# EasyEDA Pro project WCH-Link.epro

# Schematic Schematic1
Create Date: 2023-04-04; Page Name: P1; Project Name: WCH-Link; Schematic Name: Schematic1; Update Date: 2023-04-10; Company: 嘉立创EDA; Page Size: A4; Version: V1.0
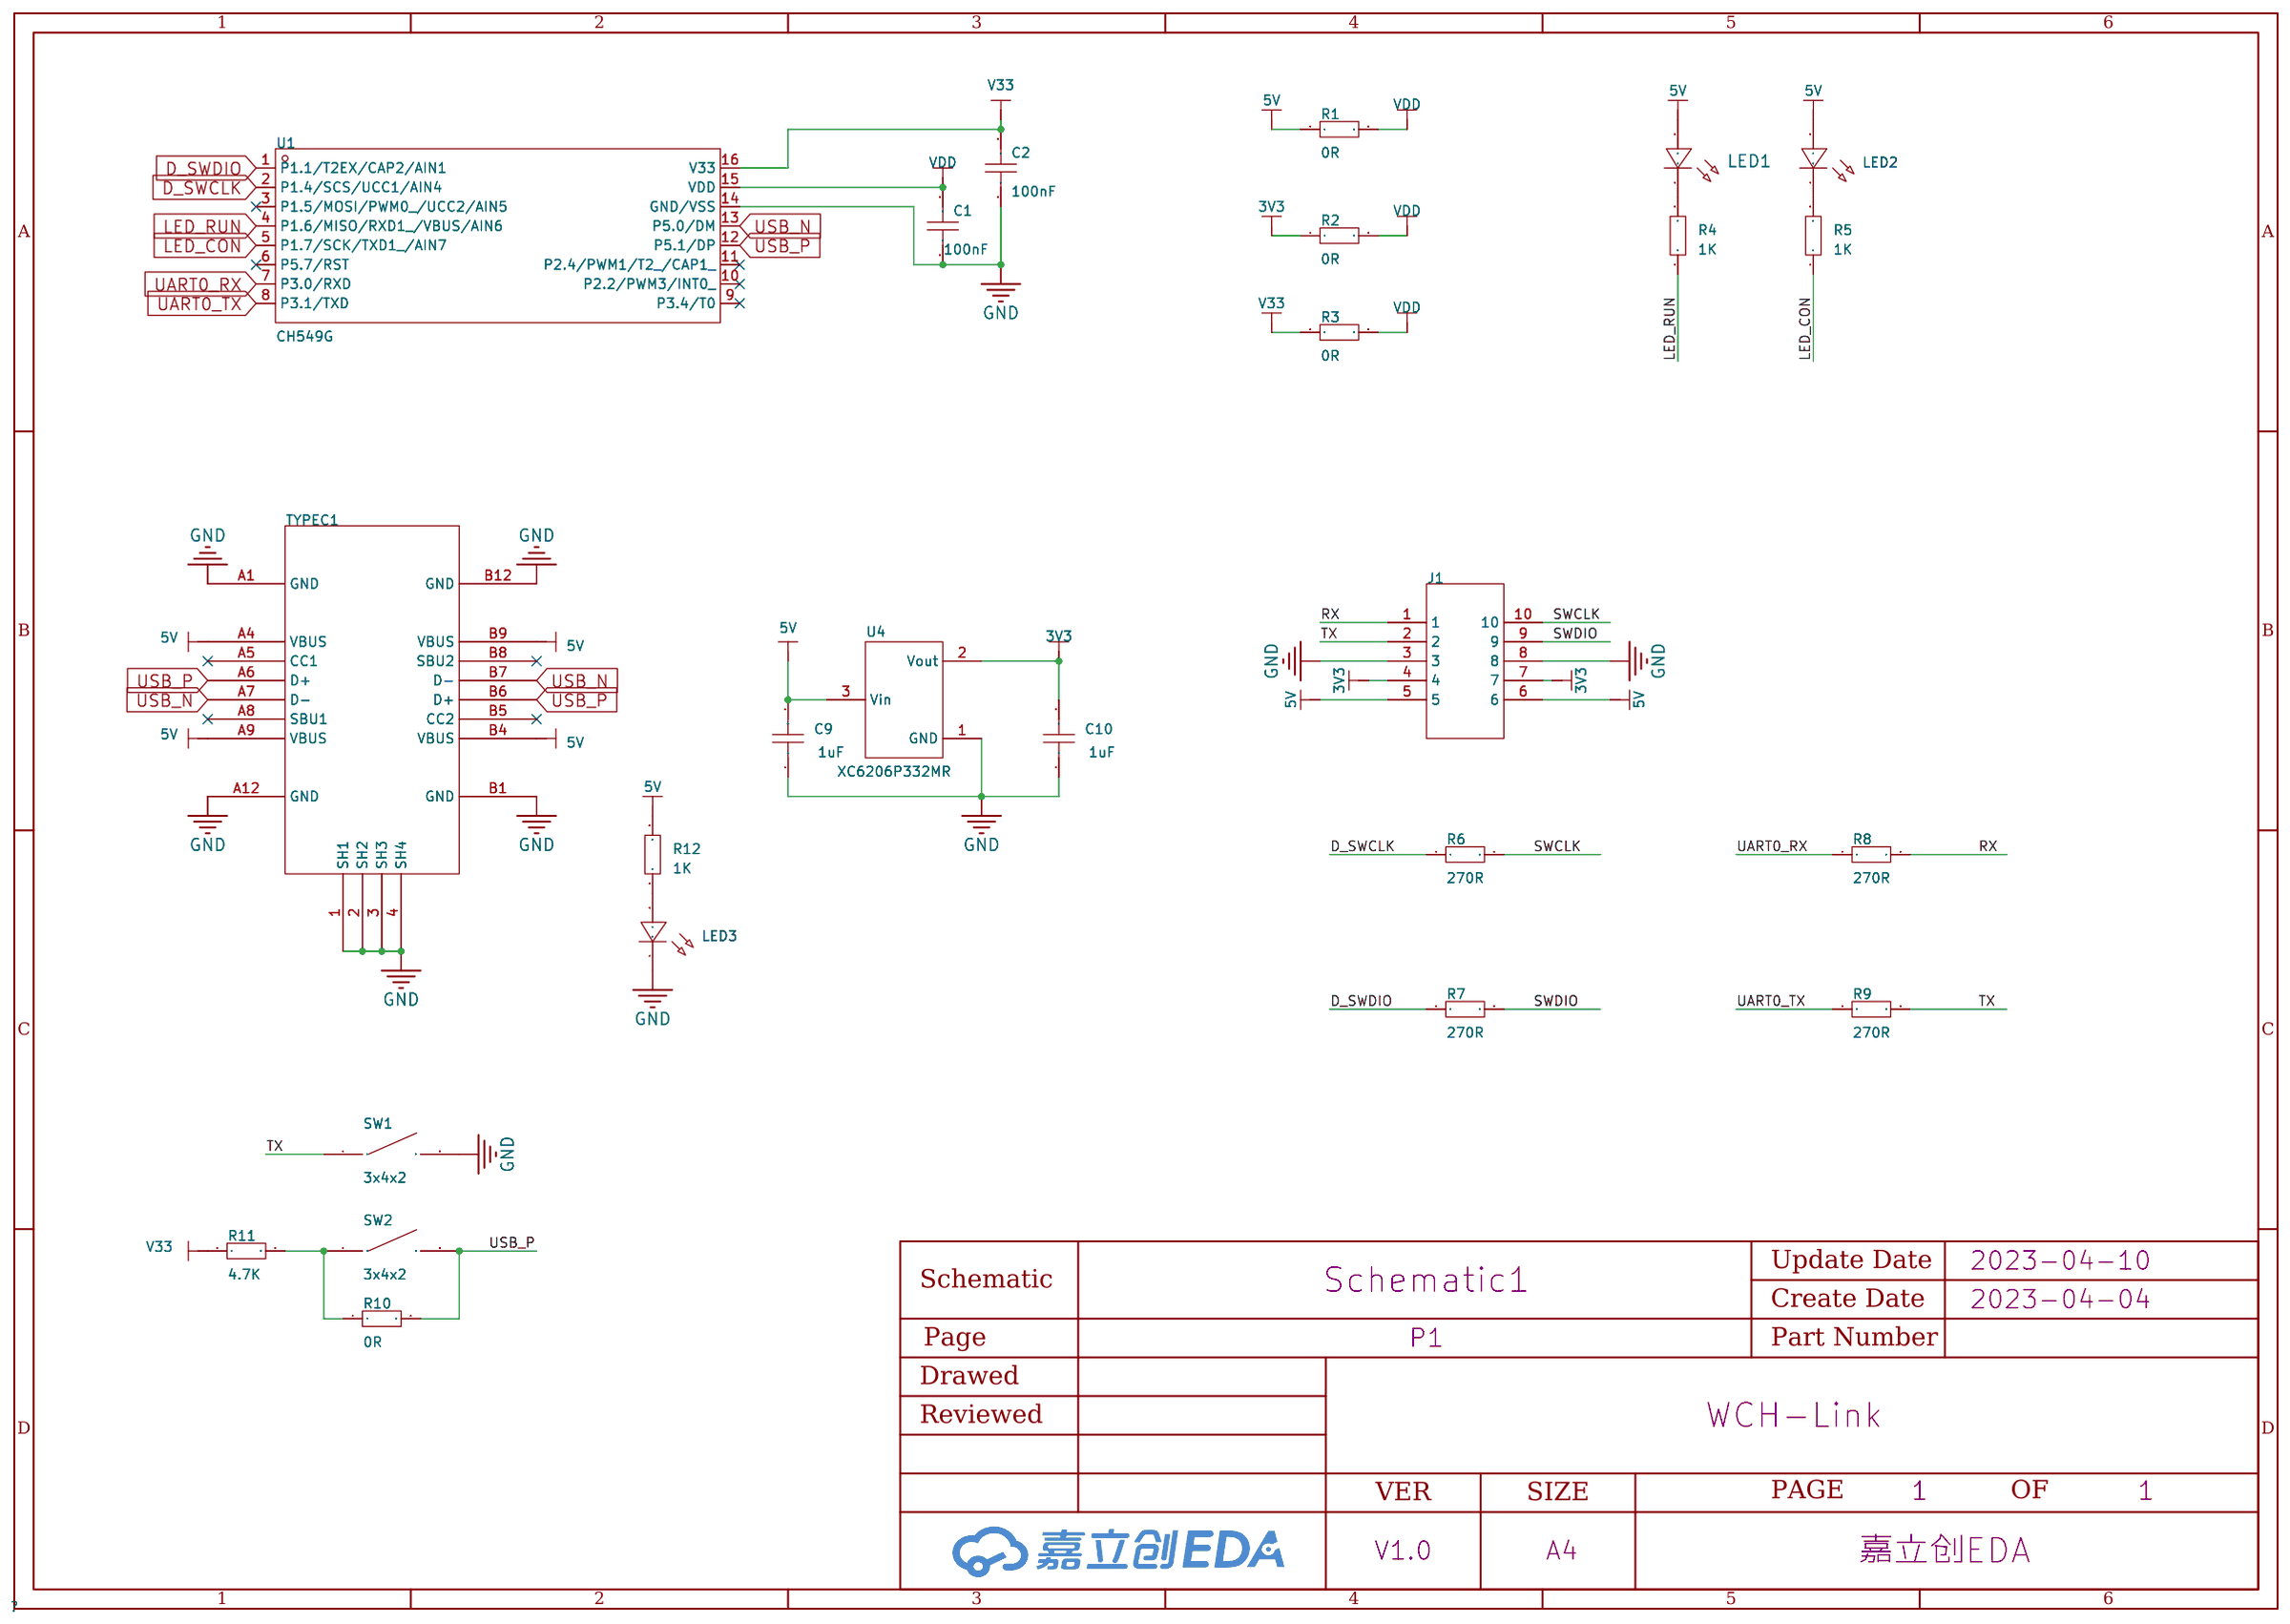
[diagram p0: schematic sheet]

## Parts
C1  100nF  [C0603]
C2  100nF  [C0603]
C9  1uF  [C0603]
C10  1uF  [C0603]
J1  -  [WCH-link-J]
LED1  -  [LED_0805]
LED2  -  [LED_0805]
LED3  -  [LED_0805]
R1  0R  [R0603]
R2  0R  [R0603]
R3  0R  [R0603]
R4  1K  [R0603]
R5  1K  [R0603]
R6  270R  [R0603]
R7  270R  [R0603]
R8  270R  [R0603]
R9  270R  [R0603]
R10  0R  [R0603]
R11  4.7K  [R0603]
R12  1K  [R0603]
SW1  3x4x2  [SW-SMD_L4.0-W2.9-LS5.0]
SW2  3x4x2  [SW-SMD_L4.0-W2.9-LS5.0]
TYPEC1  -  [TypeC-16p]
U1  CH549G  [SOP-16_L10.0-W3.9-P1.27-LS6.0-BL]
U4  XC6206P332MR  [SOT-23-3_L2.9-W1.6-P1.90-LS2.8-BR]

## Library data of the parts
C1 C2 C9 C10 = CAP_0603: Supplier Footprint: 0603
J1 = WCH-link-J
LED1 = LED_0805-R: Supplier Footprint: 0805
LED2 = LED_0805-B: Supplier Footprint: 0805
LED3 = LED_0805-G: Supplier Footprint: 0805
R1-R12 = Res_0603: Supplier Footprint: 0603
SW1 SW2 = TS-1185-C-A-B-B: 触点电流:50mA;额定电压(DC):12V;绝缘电阻:100mΩ;电路结构:单刀单掷;安装方式:立贴;按钮形状:圆形按钮;按钮/盖帽颜色:蓝色;带灯:无;作用力:260gf;机械寿命:100000;工作温度:-30~+85;开关长度:4mm;开关宽度:3mm;开关高度:2mm;带支架:否;; LCSC Part Name: 3*4*2.0硅胶260gf; Supplier Part: C465999; Manufacturer: XKB Connectivity(中国星坤); Supplier Footprint: SMD; JLCPCB Part Class: 扩展库; Datasheet: https://atta.szlcsc.com/upload/public/pdf/source/20211011/1F231F77C87DDA3AFCA2BCBA34277182.pdf; Supplier: LCSC; Contact Current: 50mA; Voltage Rating (DC): 12V; Insulation Resistance: 100mΩ; Circuit: 单刀单掷; Mounting Style: 立贴; Actuator Style: 圆形按钮; Actuator/Cap Color: 蓝色; With Lamp: 无; Operating Force: 260gf; Mechanical Life: 100000; Operating Temperature: -30~+85; Switch Length: 4mm; Switch Width: 3mm; Switch Height: 2mm; Strike Gundam: 否
TYPEC1 = TypeC-16P
U1 = CH549G: Supplier Part: C9900000386; Supplier Footprint: SOP16_L10.0-W3.9-P1.27-LS6.0; JLCPCB Part Class: Extended Part; Datasheet: https://atta.szlcsc.comnull; Supplier: LCSC
U4 = XC6206P332MR_C5446: 输出类型:固定;输出极性:正;输出通道数:1;最大输入电压:6V;输出电压:3.3V;压差:680mV@(100mA);输出电流:200mA;电源纹波抑制比(PRSS):-;; LCSC Part Name: Vin=6V Vout=3.3V 200mA; Supplier Part: C5446; Manufacturer: TOREX(特瑞仕); Supplier Footprint: SOT-23-3L; JLCPCB Part Class: 基础库; Datasheet: https://atta.szlcsc.com/upload/public/pdf/source/20130801/1457706628791.pdf; Supplier: LCSC; Output Type: 固定; Output Polarity: 正; Number of Outputs: 1; Maximum Input Voltage: 6V; Output Voltage: 3.3V; Dropout Voltage: 680mV@(100mA); Output Current: 200mA

## Nets
3V3: C10.2 J1.4 J1.7 R2.1 U4.2(Vout)
5V: C9.2 J1.5 J1.6 LED1.2(A) LED2.2(A) R1.1 R12.2 TYPEC1.A4(VBUS) TYPEC1.A9(VBUS) TYPEC1.B4(VBUS) TYPEC1.B9(VBUS) U4.3(Vin)
GND: C1.1 C2.1 C9.1 C10.1 J1.3 J1.8 LED3.1(C) SW1.2 TYPEC1.1(SH1) TYPEC1.2(SH2) TYPEC1.3(SH3) TYPEC1.4(SH4) TYPEC1.A1(GND) TYPEC1.A12(GND) TYPEC1.B1(GND) TYPEC1.B12(GND) U1.14(GND/VSS) U4.1(GND)
V33: C2.2 R3.1 R11.1 U1.16(V33)
VDD: C1.2 R1.2 R2.2 R3.2 U1.15(VDD)
D_SWCLK: R6.1 U1.2(P1.4/SCS/UCC1/AIN4)
D_SWDIO: R7.1 U1.1(P1.1/T2EX/CAP2/AIN1)
LED_CON: R5.1 U1.5(P1.7/SCK/TXD1_/AIN7)
LED_RUN: R4.1 U1.4(P1.6/MISO/RXD1_/VBUS/AIN6)
RX: J1.1 R8.2
SWCLK: J1.10 R6.2
SWDIO: J1.9 R7.2
TX: J1.2 R9.2 SW1.1
UART0_RX: R8.1 U1.7(P3.0/RXD)
UART0_TX: R9.1 U1.8(P3.1/TXD)
USB_N: TYPEC1.A7(D-) TYPEC1.B7(D-) U1.13(P5.0/DM)
USB_P: R10.2 SW2.2 TYPEC1.A6(D+) TYPEC1.B6(D+) U1.12(P5.1/DP)
$1N1452: LED1.1(C) R4.2
$1N1475: LED2.1(C) R5.2
$1N2644: R10.1 R11.2 SW2.1
$1N3710: LED3.2(A) R12.1

Not connected (* = marked no-connect by the designer): TYPEC1 A5(CC1)* A8(SBU1)* B5(CC2)* B8(SBU2)*; U1 3(P1.5/MOSI/PWM0_/UCC2/AIN5)* 6(P5.7/RST)* 9(P3.4/T0)* 10(P2.2/PWM3/INT0_)* 11(P2.4/PWM1/T2_/CAP1_)*

# Board PCB1
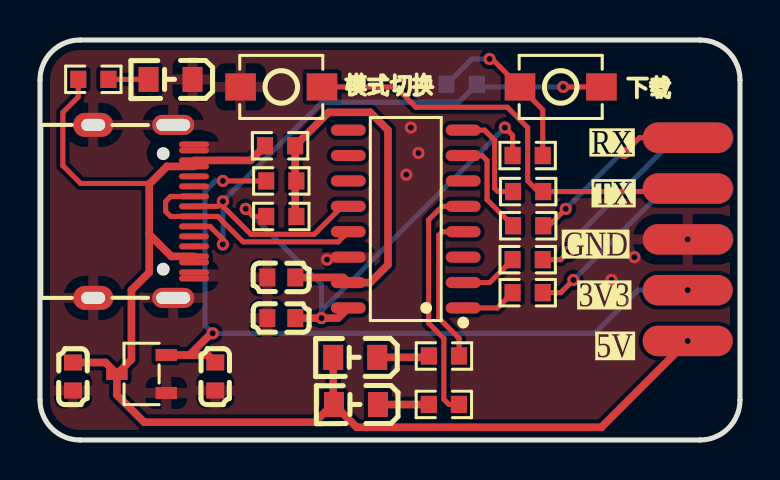
[diagram p1: board, top side]
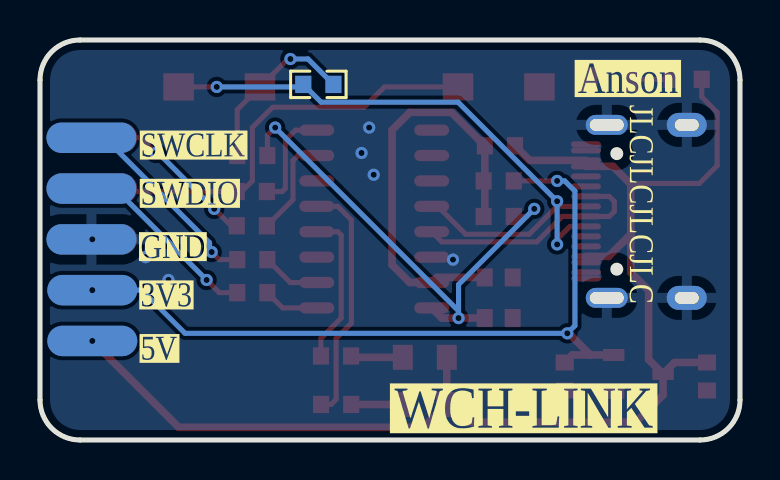
[diagram p2: board, bottom side, seen from below]

Outline 35 x 20 mm; copper layers: Top Layer, Bottom Layer. Coordinates in mm from the lower left corner of the outline.
Outline path: 0,18 0,2 arc(0.59,0.59) 2,0 33,0 arc(34.41,0.59) 35,2 35,18 arc(34.41,19.41) 33,20 2,20 arc(0.59,19.41) 0,18
Stack: Top Layer 0.035mm / Dielectric1 1.51mm FR4 er 4.5 / Bottom Layer 0.035mm

## Design rules (mm)
template: 自定义配置
spacing copperThickness1oz (default): track to track 0.102, other pairs 0.152 to 0.3
spacing copperThickness2oz: track to track 0.203, other pairs 0.152 to 0.3
track width copperThickness1oz (default): min 0.127, default 0.254, max 2.54
track width copperThickness2oz: min 0.203, default 0.254, max 2.54
differential pair differentialPair (default): width min 0.127, default 0.254, max 2.54; gap min 0.152, default 0.152
via viaSize (default): diameter min 0.5, default 0.61, max 10; hole min 0.3, default 0.305, max 6.3

## Placement (name value [footprint] x y rotation side)
C1  100nF  [C0603]  12.06 8.13 0 top
C2  100nF  [C0603]  12.06 6.1 0 top
C9  1uF  [C0603]  1.65 3.17 90 top
C10  1uF  [C0603]  8.76 3.17 90 top
J1  -  [WCH-link-J]  32.26 9.91 0 top
LED1  -  [LED_0805]  15.71 4.14 180 top
LED2  -  [LED_0805]  15.75 1.78 180 top
LED3  -  [LED_0805]  6.48 18.03 180 top
R1  0R  [R0603]  12 14.71 0 top
R2  0R  [R0603]  12.06 12.95 0 top
R3  0R  [R0603]  12.06 11.18 0 top
R4  1K  [R0603]  20.2 4.2 180 top
R5  1K  [R0603]  20.19 1.78 180 top
R6  270R  [R0603]  24.38 9.02 0 top
R7  270R  [R0603]  24.38 7.37 0 top
R8  270R  [R0603]  24.41 10.71 0 top
R9  270R  [R0603]  24.41 12.42 0 top
R10  0R  [R0603]  21.08 17.78 0 bottom
R11  4.7K  [R0603]  24.38 14.22 0 top
R12  1K  [R0603]  2.67 18.03 180 top
SW1  3x4x2  [SW-SMD_L4.0-W2.9-LS5.0]  12.06 17.65 180 top
SW2  3x4x2  [SW-SMD_L4.0-W2.9-LS5.0]  26.03 17.65 0 top
TYPEC1  -  [TypeC-16p]  4.19 11.43 180 top
U1  CH549G  [SOP-16_L10.0-W3.9-P1.27-LS6.0-BL]  18.29 11.05 90 top
U4  XC6206P332MR  [SOT-23-3_L2.9-W1.6-P1.90-LS2.8-BR]  5.08 3.3 0 top

## Footprints (pads in the part's own frame, mm; a bottom-side part is the same pattern mirrored in y, then rotated)
C0603
  rect 0.8x0.9 smd: 1(-0.7,0) 2(0.7,0)
LED_0805
  rect 1x1.25 smd: 1(-1.15,0.005) 2(1.05,0.005)
R0603
  rect 0.806x0.864 smd: 1(-0.753,0) 2(0.753,0)
SOP-16_L10.0-W3.9-P1.27-LS6.0-BL
  oval 0.56x1.745 smd: 1(-4.445,-2.873) 2(-3.175,-2.873) 3(-1.905,-2.873) 4(-0.635,-2.873) 5(0.635,-2.873) 6(1.905,-2.873) 7(3.175,-2.873) 8(4.445,-2.873) 9(4.445,2.873) 10(3.175,2.873) 11(1.905,2.873) 12(0.635,2.873) 13(-0.635,2.873) 14(-1.905,2.873) 15(-3.175,2.873) 16(-4.445,2.873)
SOT-23-3_L2.9-W1.6-P1.90-LS2.8-BR
  rect 1.07x0.6 smd: 1(1.235,-0.95) 2(1.235,0.95) 3(-1.235,0)
SW-SMD_L4.0-W2.9-LS5.0
  rect 1.53x1.36 smd: 1(-2.035,0) 2(2.035,0)
TypeC-16p
  oval 2.1x1 hole 1.7x0.6: 1(-2.47,-4.325) 4(-2.47,4.325)
  oval 2x1.2 hole 1.2x0.6: 2(1.53,-4.325) 3(1.53,4.325)
  rrect 1.5x0.3 smd: A1(-3.51,-3.35) A4(-3.51,-2.55) A5(-3.51,-1.25) A6(-3.51,-0.25) A7(-3.51,0.25) A8(-3.51,1.25) A9(-3.51,2.55) A12(-3.51,3.35) B1(-3.51,3.05) B4(-3.51,2.25) B5(-3.51,1.75) B6(-3.51,0.75) B7(-3.51,-0.75) B8(-3.51,-1.75) B9(-3.51,-2.25) B12(-3.51,-3.05)
WCH-link-J
  oval 4.5x1.524 smd: 1(0.127,5.207) 2(0.127,2.667) 3(0.127,0.127) 4(0.127,-2.413) 5(0.127,-4.953)
  oval 4.5x1.524 smd far side: 6(0.127,-4.953) 7(0.127,-2.413) 8(0.172,0.127) 9(0.172,2.667) 10(0.172,5.207)

## Nets
As in the schematic.

Pads without a net: TYPEC1 A5 A8 B5 B8; U1 3 6 9 10 11

## Via types
v1: diameter 0.61, hole 0.305, Top Layer to Bottom Layer, 22 vias

## Routing (per net, layer and track width the routed paths; a pad name or vN(x,y) marks a point on that pad's centre or on a via; arc(x,y) is an arc through that point)
3V3: length 39.4
  Top Layer w0.254: v1(9.14,12.95) R2.1
  Top Layer w0.381: v1(8.64,5.33) 8.56,5.33 7.48,4.25 ; U4.2 7.48,4.25 ; 7.48,4.25 8.39,4.25 C10.2
  Bottom Layer w0.254: v1(32.38,7.49) 29.91,7.49 27.75,5.33 v1(8.64,5.33) 8.25,5.72 8.25,12.45 8.76,12.95 v1(9.14,12.95)
5V: length 66.2
  Top Layer w0.254: 5.5,12.83 2.03,12.83 1.14,13.72 1.14,16.38 1.91,17.15 R12.2
  Top Layer w0.381: 5.46,10.29 5.46,12.79 6.35,13.68 TYPEC1.B9 ; 5.46,10.29 5.46,8.38 4.57,7.49 4.57,4.03 U4.3 ; 5.46,10.29 6.57,9.18 TYPEC1.B4 ; TYPEC1.A4 10.52,13.98 R1.1 ; U4.3 3.27,3.88 C9.2 ; U4.3 3.84,2.25 5.21,0.89 13.74,0.89 14.66,1.81 ; v1(32.38,4.95) 28.07,0.64 15.84,0.64 14.7,1.77 14.66,1.81 ; 14.66,1.81 LED1.2
GND:
  vias: v1(14.35,9.02) v1(18.31,13.26) v1(18.54,15.62) v1(18.92,14.35) v1(28.57,8) v1(29.72,9.14) v1(32.38,10.03)
V33: length 25.6
  Top Layer w0.254: R3.1 10.67,11.18 v1(10.29,11.56) ; R11.1 23.63,15.23 v1(23.24,15.62)
  Top Layer w0.381: U1.16 14.91,6.1 v1(14.07,6.1) C2.2
  Bottom Layer w0.254: 14.07,6.45 14.07,7.77 v1(10.29,11.56) ; 14.07,6.45 v1(14.07,6.1) ; 14.07,6.45 v1(23.24,15.62)
VDD: length 21.1
  Top Layer w0.381: C1.2 15.16,8.13 U1.15 16.51,7.87 17.4,8.76 17.4,15.49 16.51,16.38 14.43,16.38 R1.2 12.76,11.24 R3.2
D_SWCLK: length 2.9
  Top Layer w0.254: R6.1 22.49,7.87 U1.2
D_SWDIO: length 2.8
  Top Layer w0.254: U1.1 22.87,6.6 R7.1
LED_CON: length 12.2
  Top Layer w0.254: U1.5 20.11,11.68 19.43,11 19.43,5.84 20.19,5.08 20.19,2.03 20.45,1.78 R5.1
LED_RUN: length 7.8
  Top Layer w0.254: U1.4 20.11,10.41 19.94,10.24 19.94,6.1 20.96,5.08 20.96,4.2 R4.1
RX: length 9
  Top Layer w0.254: v1(29.21,14.35) 29.97,15.11 32.38,15.11 ; R8.2 25.44,10.71 v1(26.29,11.56)
  Bottom Layer w0.254: v1(29.21,14.35) 29.08,14.35 v1(26.29,11.56)
SWCLK: length 10
  Top Layer w0.254: R6.2 26.03,9.02 v1(26.42,9.4)
  Bottom Layer w0.254: v1(26.42,9.4) 26.52,9.5 26.52,9.86 31.77,15.11 J1.10
SWDIO: length 9.4
  Top Layer w0.254: R7.2 26.03,7.37 v1(26.67,8)
  Bottom Layer w0.254: v1(26.67,8) 31.24,12.57 32.43,12.57
TX: length 22.1
  Top Layer w0.254: SW1.1 17.78,17.65 18.8,16.64 23.37,16.64 24.38,15.62 24.38,12.95 24.92,12.42 R9.2 32.23,12.42 32.38,12.57
UART0_RX: length 5.1
  Top Layer w0.254: R8.1 22.35,12.01 22.35,13.97 22.1,14.22 U1.7
UART0_TX: length 5.2
  Top Layer w0.254: U1.8 22.22,15.49 22.73,14.99 22.73,12.58 22.89,12.42 R9.1
USB_N: length 12
  Top Layer w0.254: U1.13 14.91,9.91 10.16,9.91 8.89,11.18 TYPEC1.A7 7.7,11.18 6.54,11.18 6.28,11.43 6.28,11.93 6.54,12.18 TYPEC1.B7
USB_P: length 34.8
  Top Layer w0.254: SW2.2 v1(26.16,17.65) ; U1.12 15.11,11.68 13.72,10.29 10.54,10.29 9.14,11.68 v1(9.14,11.94) 8.89,11.68 TYPEC1.A6 ; v1(9.14,9.78) 9.14,10.03 8.5,10.68 TYPEC1.B6
  Bottom Layer w0.254: v1(26.16,17.65) 21.96,17.65 R10.2 20.95,16.89 14.1,16.89 v1(9.14,11.94) v1(9.14,9.78)
$1N1452: length 2.6
  Top Layer w0.381: 16.86,4.13 19.38,4.13 R4.2
$1N1475: length 2.7
  Top Layer w0.381: 19.58,1.79 19.56,1.77 16.9,1.77
$1N2644: length 8.7
  Top Layer w0.254: v1(22.48,19.05) 22.6,19.05 SW2.1 25.14,16.52 R11.2
  Bottom Layer w0.254: R10.1 21.6,19.05 v1(22.48,19.05)
$1N3710: length 2
  Top Layer w0.254: R12.1 5.42,18.03 5.43,18.03

## Copper pours and planes (outline as drawn; the poured copper is in the pictures)
GND on Top Layer: -0.13,20.07 35.18,20.07 35.18,-0.13 -0.13,-0.13
GND on Bottom Layer: -0.13,20.07 35.18,20.07 35.18,-0.13 -0.13,-0.13

## Text on the board
Bottom Silkscreen Layer: SWCLK | SWDIO | GND | 3V3 | 5V | JLCJLCJLCJLC | Anson | WCH-LINK
Top Silkscreen Layer: GND | 3V3 | RX | TX | 5V | 模式切换 | 下载
